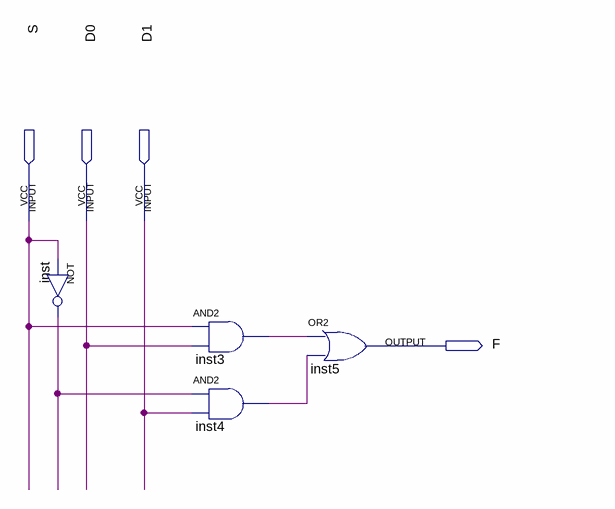
[diagram p0: schematic sheet]
// Quartus schematic ex1-1-remake.bdf as structural Verilog: 4 symbols, 4 pins
module \ex1-1-remake  (
  input  S,
  input  D0,
  input  D1,
  output F
);

  wire inst3_out, inst4_out, inst_out;

  not inst (inst_out, S);
  and inst3 (inst3_out, S, D0);
  and inst4 (inst4_out, inst_out, D1);
  or inst5 (F, inst3_out, inst4_out);
endmodule
